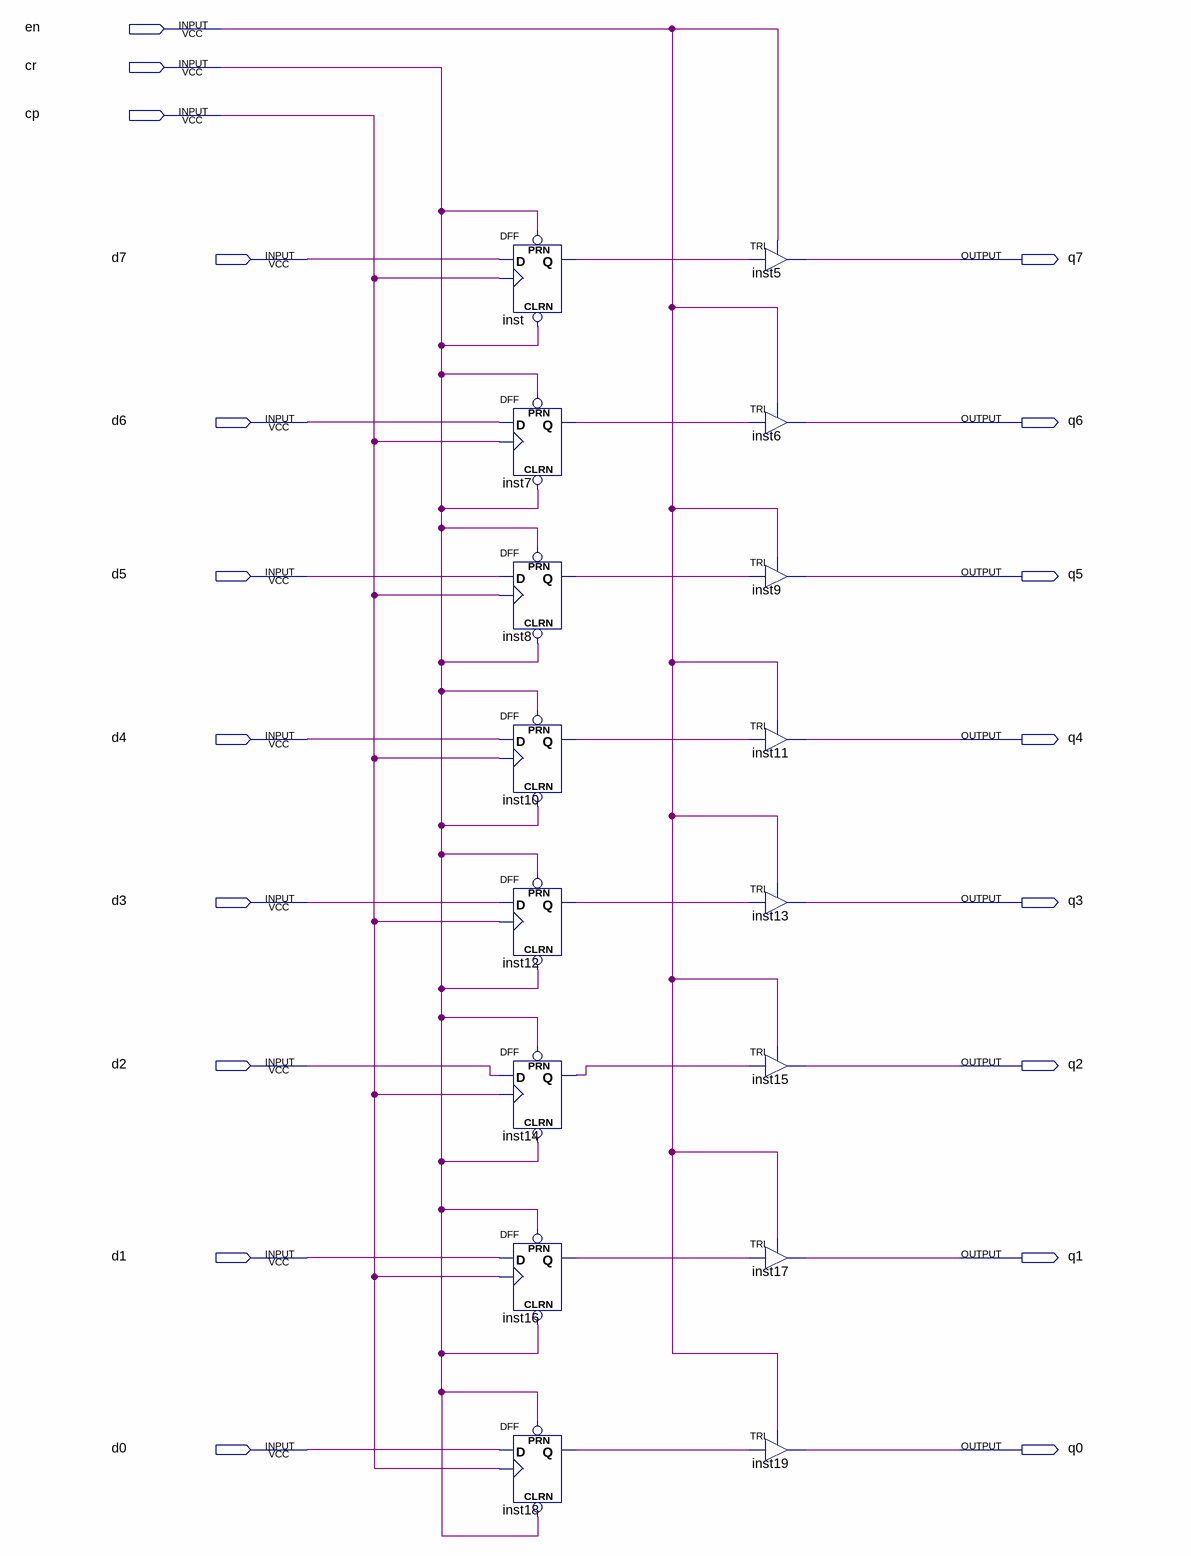
[diagram p0: schematic sheet]
// Quartus schematic MBR.bdf as structural Verilog: 16 symbols, 19 pins
module MBR (
  input  en,
  input  cr,
  input  cp,
  input  d7,
  input  d6,
  input  d5,
  input  d4,
  input  d3,
  input  d2,
  input  d1,
  input  d0,
  output q7,
  output q6,
  output q5,
  output q4,
  output q3,
  output q2,
  output q1,
  output q0
);

  wire inst7_q, inst8_q, inst10_q, inst12_q, inst14_q, inst16_q, inst18_q, inst_q;

  DFF inst (.CLRN(cr), .CLK(cp), .D(d7), .PRN(cr), .Q(inst_q));
  DFF inst7 (.CLRN(cr), .CLK(cp), .D(d6), .PRN(cr), .Q(inst7_q));
  DFF inst8 (.CLRN(cr), .CLK(cp), .D(d5), .PRN(cr), .Q(inst8_q));
  DFF inst10 (.CLRN(cr), .CLK(cp), .D(d4), .PRN(cr), .Q(inst10_q));
  DFF inst12 (.CLRN(cr), .CLK(cp), .D(d3), .PRN(cr), .Q(inst12_q));
  DFF inst14 (.CLRN(cr), .CLK(cp), .D(d2), .PRN(cr), .Q(inst14_q));
  DFF inst16 (.CLRN(cr), .CLK(cp), .D(d1), .PRN(cr), .Q(inst16_q));
  DFF inst18 (.CLRN(cr), .CLK(cp), .D(d0), .PRN(cr), .Q(inst18_q));
  TRI inst5 (.IN(inst_q), .OE(en), .OUT(q7));
  TRI inst6 (.IN(inst7_q), .OE(en), .OUT(q6));
  TRI inst9 (.IN(inst8_q), .OE(en), .OUT(q5));
  TRI inst11 (.IN(inst10_q), .OE(en), .OUT(q4));
  TRI inst13 (.IN(inst12_q), .OE(en), .OUT(q3));
  TRI inst15 (.IN(inst14_q), .OE(en), .OUT(q2));
  TRI inst17 (.IN(inst16_q), .OE(en), .OUT(q1));
  TRI inst19 (.IN(inst18_q), .OE(en), .OUT(q0));
endmodule
